# EAGLE design usb-interface (EAGLE 5.04)
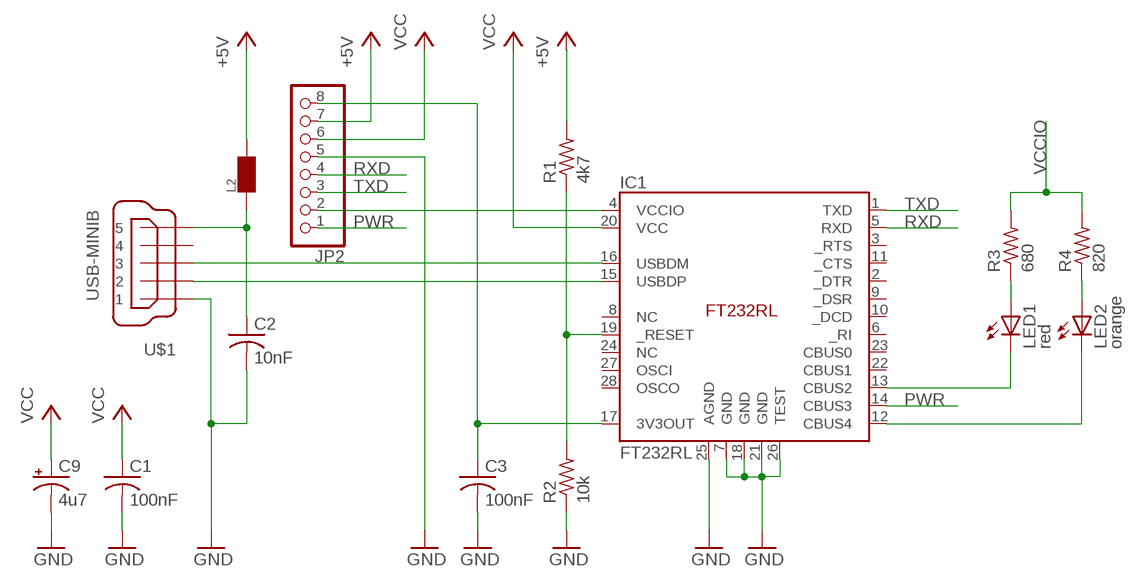
[diagram p0: schematic, sheet 1]

## Parts
C1  100nF  C-USC0603  [C0603]
C2  10nF  C-USC0603  [C0603]
C3  100nF  C-USC0603  [C0603]
C9  4u7  CPOL-USSMCA  [SMC_A]
IC1  FT232RL  [SSOP-28]
JP2  PINHD-1X8  [1X08]
L2  BDS-3/3/4.6-4S2  [BDS-3/3/4.6]
LED1  red  LEDCHIP-LED0603  [CHIP-LED0603]
LED2  orange  LEDCHIP-LED0603  [CHIP-LED0603]
R1  4k7  R-US_R0402  [R0402]
R2  10k  R-US_R0402  [R0402]
R3  680  R-US_R0402  [R0402]
R4  820  R-US_R0402  [R0402]
U$1  USB-MINIB  [MINI-B]

## Nets
3V3_OUT: C3.1 IC1.17(3V3OUT) JP2.8
+5V: JP2.7 L2.P$2 R1.2
GND: C1.2 C2.2 C3.2 C9.- IC1.7(GND) IC1.18(GND) IC1.21(GND) IC1.25(AGND) IC1.26(TEST) JP2.5 R2.1 U$1.P$1
N$1: IC1.19(_RESET) R1.1 R2.2
N$2: C2.1 L2.P$1 U$1.P$5
N$3: IC1.16(USBDM) U$1.P$3
N$4: IC1.15(USBDP) U$1.P$2
N$5: IC1.13(CBUS2) LED1.C
N$6: IC1.12(CBUS4) LED2.C
N$7: LED1.A R3.1
N$8: LED2.A R4.1
PWR: IC1.14(CBUS3) JP2.1
RXD: IC1.5(RXD) JP2.4
TXD: IC1.1(TXD) JP2.3
VCC: C1.1 C9.+ IC1.20(VCC) JP2.6
VCCIO: IC1.4(VCCIO) JP2.2 R3.2 R4.2
Unconnected: IC1.2(_DTR) IC1.3(_RTS) IC1.6(_RI) IC1.8(NC) IC1.9(_DSR) IC1.10(_DCD) IC1.11(_CTS) IC1.22(CBUS1) IC1.23(CBUS0) IC1.24(NC) IC1.27(OSCI) IC1.28(OSCO) U$1.P$4

## Library data of the parts
C1-C3 = rcl:C-US: CAPACITOR, American symbol
C9 = rcl:CPOL-US: POLARIZED CAPACITOR, American symbol
IC1 = ftdi4:FT232RL
JP2 = pinhead:PINHD-1X8: PIN HEADER
L2 = bws-ferrite:BDS-3/3/4.6-4S2
LED1 LED2 = led:LED: LED OSRAM: - CHIPLED LG R971, LG N971, LY N971, LG Q971, LY Q971, LO R971, LY R971 LH N974, LH R974 LS Q976, LO Q976, LY Q976 LO Q996 - Hyper CHIPLED LW Q18S LB Q993, LB Q99A, LB R99A - SideLED LS A670, LO A670, LY A670, LG A670, LP A670 LB A673, LV A673, LT A673, LW A673 LH A674 LY A675 LS A676, LA A676, LO A676, LY A676, LW A676 LS A679, LY A679, LG A679 - Hyper Micro SIDELED® LS Y876, LA Y876, LO Y876, LY Y876 LT Y87S - SmartLED LW L88C, LW L88S LB L89C, LB L89S, LG L890 LS L89K, LO L89K, LY L89K LS L896, LA L896, LO L896, LY L896 - TOPLED LS T670, LO T670, LY T670, LG T670, LP T670 LSG T670, LSP T670, LSY T670, LOP T670, LYG T670 LG T671, LOG T671, LSG T671 LB T673, LV T673, LT T673, LW T673 LH T674 LS T676, LA T676, LO T676, LY T676, LB T676, LH T676, LSB T676, LW T676 LB T67C, LV T67C, LT T67C, LS T67K, LO T67K, LY T67K, LW E67C LS E67B, LA E67B, LO E67B, LY E67B, LB E67C, LV E67C, LT E67C LW T67C LS T679, LY T679, LG T679 LS T770, LO T770, LY T770, LG T770, LP T770 LB T773, LV T773, LT T773, LW T773 LH T774 LS E675, LA E675, LY E675, LS T675 LS T776, LA T776, LO T776, LY T776, LB T776 LHGB T686 LT T68C, LB T68C - Hyper Mini TOPLED® LB M676 - Mini TOPLED Santana® LG M470 LS M47K, LO M47K, LY M47K Source: http://www.osram.convergy.de LUXEON: - LUMILED® LXK2-PW12-R00, LXK2-PW12-S00, LXK2-PW14-U00, LXK2-PW14-V00 LXK2-PM12-R00, LXK2-PM12-S00, LXK2-PM14-U00 LXK2-PE12-Q00, LXK2-PE12-R00, LXK2-PE12-S00, LXK2-PE14-T00, LXK2-PE14-U00 LXK2-PB12-K00, LXK2-PB12-L00, LXK2-PB12-M00, LXK2-PB14-N00, LXK2-PB14-P00, LXK2-PB14-Q00 LXK2-PR12-L00, LXK2-PR12-M00, LXK2-PR14-Q00, LXK2-PR14-R00 LXK2-PD12-Q00, LXK2-PD12-R00, LXK2-PD12-S00 LXK2-PH12-R00, LXK2-PH12-S00 LXK2-PL12-P00, LXK2-PL12-Q00, LXK2-PL12-R00 Source: www.luxeon.com KINGBRIGHT: KA-3528ASYC Source: www.kingbright.com
R1-R4 = rcl:R-US_: RESISTOR, American symbol
U$1 = molex-usb:USB-MINIB

## Board
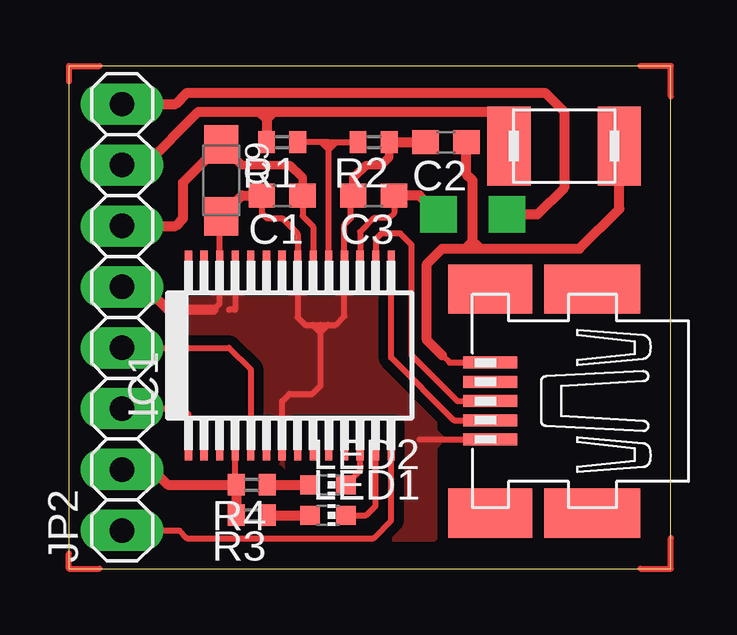
[diagram p1: board, top side]
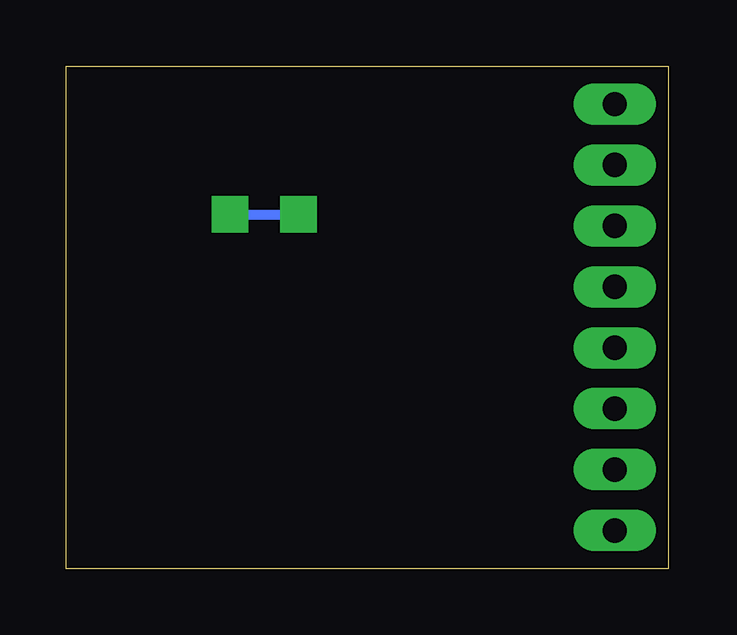
[diagram p2: board, bottom side, seen from below]

Size 25.08 x 20.95 mm. Coordinates in mm from the lower left corner, seen from the top.
Outline: 0,0 25.08,0 25.08,20.95 0,20.95 0,0
Copper layers (1*16): Top 0.035mm / dielectric 1.5mm / Bottom 0.035mm
Design rules "default *": minimum track width 10mil, minimum drill 24mil, track to track 12mil, track to pad 12mil, pad to pad 12mil, via to via 8mil, smd to smd 8mil, copper to edge 40mil, drill to drill 8mil, minimum pad ring 14mil, minimum via ring 8mil, stop-mask expansion 4mil, vias tented up to drill 0mil, thermal gap 10mil

### Footprints (pad centres in the part's own frame; a part is rotated, then mirrored left to right if it is on the bottom)
C0603 = smd 1.1 x 1: 1 -0.85,0; 2 0.85,0
SMC_A = smd 1.6 x 1.4: + -1.5,0; - 1.5,0
SSOP-28 = smd 0.3 x 1.5: 1 -4.225,-3.625; 2 -3.575,-3.625; 3 -2.925,-3.625; 4 -2.275,-3.625; 5 -1.625,-3.625; 6 -0.975,-3.625; 7 -0.325,-3.625; 8 0.325,-3.625; 9 0.975,-3.625; 10 1.625,-3.625; 11 2.275,-3.625; 12 2.925,-3.625; 13 3.575,-3.625; 14 4.225,-3.625; 15 4.225,3.625; 16 3.575,3.625; 17 2.925,3.625; 18 2.275,3.625; 19 1.625,3.625; 20 0.975,3.625; 21 0.325,3.625; 22 -0.325,3.625; 23 -0.975,3.625; 24 -1.625,3.625; 25 -2.275,3.625; 26 -2.925,3.625; 27 -3.575,3.625; 28 -4.225,3.625
1X08 = drill 1.016 long: 1 -8.89,0; 2 -6.35,0; 3 -3.81,0; 4 -1.27,0; 5 1.27,0; 6 3.81,0; 7 6.35,0; 8 8.89,0
BDS-3/3/4.6 = smd 1.8 x 3.3: P$1 -2.3,0; P$2 2.3,0
CHIP-LED0603 = smd 0.8 x 0.8: A 0,-0.75; C 0,0.75
R0402 = smd 0.7 x 0.9: 1 -0.65,0; 2 0.65,0
MINI-B = smd 2.25 x 0.5: P$1 6.25,1.6; P$2 6.25,0.8; P$3 6.25,0; P$4 6.25,-0.8; P$5 6.25,-1.6 | smd 4 x 2.05: Z$1 2,4.675; Z$3 2,-4.675 | smd 3.5 x 2.05: Z$2 6.25,4.675; Z$4 6.25,-4.675

### Placement (x,y rotation side)
C1  8.89,15.56 180 top
C2  15.72,17.78 180 top
C3  12.7,15.56 180 top
C9  6.35,16.19 270 top
IC1  9.21,8.89 0 top
JP2  2.22,10.48 90 top
L2  20.64,17.62 180 top
LED1  10.8,2.22 270 top
LED2  10.8,3.49 270 top
R1  8.89,17.78 180 top
R2  12.7,17.78 180 top
R3  7.62,2.22 180 top
R4  7.62,3.49 180 top
U$1  23.81,6.98 180 top

### Tracks (layer width: path | path; a pad name or v marks a point on that pad's centre or on a via)
3V3_OUT  (via drill 0 pad 1.52)
  Top 0.254: IC1.17 12.13,14.04 12.7,14.61 13.34,14.61 13.55,14.82 C3.1
  Top 0.406: JP2.8 4.45,19.37 4.92,19.84 19.84,19.84 | 19.84,19.84 | 19.84,19.84 20.64,19.05 20.64,15.88 19.53,14.76 v18.26,14.76 | v15.4,14.76 | v15.4,14.76 14.6,15.56 C3.1
  Bottom 0.406: v18.26,14.76 v15.4,14.76
+5V
  Top 0.254: 8.24,19.05 8.24,18.73
  Top 0.406: 7.92,19.05 5.4,19.05 3.18,16.83 JP2.7 | 7.92,19.05 8.24,19.05 8.56,19.05 | 8.24,18.73 R1.2 | 8.24,18.73 8.56,19.05 | 7.92,19.05 8.24,18.73 | L2.P$2 18.34,18.81 18.1,19.05 8.56,19.05
GND
  Top 0.254: 10.16,10.16 10.48,10.16 | 10.16,10.16 9.84,10.16 9.53,10.47 IC1.21 9.53,13.96 8.89,14.61 8.26,14.61 8.04,14.82 C1.2 | 10.48,10.16 10.8,10.16 | 10.8,10.16 11.11,10.16 11.48,10.53 IC1.18 11.48,14.34 11.75,14.61 11.75,15.45 C3.2 | 10.16,7.29 9.2,7.29 8.88,6.98 IC1.7 | 10.48,9.84 10.48,7.62 10.16,7.3 | 10.48,10.16 10.48,9.84 | 10.16,10.16 10.48,9.84 | 10.48,9.84 10.8,10.16 | C9.- 6.28,14.62 IC1.26 6.28,11.04 6.03,10.79 | IC1.25 6.93,10.79 6.67,10.79 | 14.62,5.38 U$1.P$1
  Top 0.356: C3.2 11.85,16.29 12.38,16.83 13.02,16.83 13.35,17.16 R2.1
  Top 0.406: C9.- 7.21,15.56 C1.2 | JP2.5 3.18,11.75 4.13,10.79 6.03,10.79 | R2.1 C2.2
  pour Top (isolate 0.406): 13.65,12.07 4.76,12.07 4.76,1.27 15.24,1.27 15.24,5.08 15.56,5.4 15.24,5.71 15.24,9.05 13.65,9.05
N$1
  Top 0.254: 10.83,17.78 10.52,17.78 | 10.52,17.78 R1.1 | IC1.19 10.83,17.46 | 10.83,17.46 10.83,17.78 | 10.83,17.78 11.15,17.78 | 11.15,17.78 R2.2 | 10.83,17.46 11.15,17.78 | 10.83,17.46 10.52,17.78
N$2
  Top 0.254: U$1.P$5 15.86,8.59 15.56,8.89
  Top 0.406: 16.83,13.34 15.56,13.34 14.92,12.7 14.92,9.52 15.56,8.89 | 16.83,13.34 21.27,13.34 22.94,15 L2.P$1 | C2.1 16.57,16.45 16.83,16.19 16.83,13.65 | 16.83,13.34 16.83,13.65 | 16.83,13.65 16.51,13.34 | 16.83,13.65 17.15,13.34
N$3
  Top 0.254: IC1.16 12.78,13.73 13.02,13.97 13.81,13.97 14.29,13.49 14.29,8.89 16.19,6.98 U$1.P$3
N$4
  Top 0.254: IC1.15 13.43,8.79 16.04,6.18 U$1.P$2
N$5
  Top 0.254: IC1.13 12.78,2.62 12.38,2.22 LED1.C
N$6
  Top 0.254: IC1.12 12.13,4.08 LED2.C
N$7
  Top 0.406: R3.1 LED1.A
N$8
  Top 0.406: R4.1 LED2.A
N$9
  Top 0.254: 23.81,20.95 25.08,20.95 25.08,19.68
N$10
  Top 0.254: 23.81,0 25.08,0 25.08,1.27
N$11
  Top 0.254: 0,0.63 0,0 1.27,0
N$12
  Top 0.254: 0,20.32 0,20.95 1.27,20.95
PWR
  Top 0.254: IC1.14 13.43,2 12.7,1.27 4.92,1.27 4.6,1.59 JP2.1
RXD
  Top 0.254: IC1.5 7.58,8.29 6.67,9.21 JP2.4
TXD
  Top 0.254: IC1.1 4.98,6.45 4.76,6.67 JP2.3
VCC
  Top 0.254: IC1.20 10.18,14.27 9.74,14.71 C1.1
  Top 0.356: C1.1 9.74,16.29 9.21,16.83 7.21,16.83 C9.+
  Top 0.406: JP2.6 4.45,14.29 4.76,14.61 4.76,16.11 C9.+
VCCIO
  Top 0.254: IC1.4 6.93,3.53 R4.2
  Top 0.406: R3.2 R4.2 4.13,3.49 3.49,4.13 JP2.2